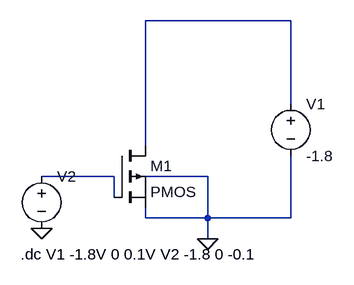
[diagram p0: schematic pmos.asc]
pmos.asc, the LTspice schematic file:
Version 4
SHEET 1 880 680
WIRE 384 -64 160 -64
WIRE 384 64 384 -64
WIRE 160 128 160 -64
WIRE 112 176 0 176
WIRE 256 176 160 176
WIRE 112 208 112 176
WIRE 160 240 160 224
WIRE 256 240 256 176
WIRE 256 240 160 240
WIRE 384 240 384 144
WIRE 384 240 256 240
WIRE 256 272 256 240
FLAG 256 272 0
FLAG 0 256 0
SYMBOL voltage 384 48 R0
WINDOW 123 0 0 Left 0
WINDOW 39 0 0 Left 0
SYMATTR InstName V1
SYMATTR Value -1.8
SYMBOL voltage 0 160 R0
WINDOW 123 0 0 Left 0
WINDOW 39 0 0 Left 0
SYMATTR InstName V2
SYMATTR Value ""
SYMBOL pmos 112 128 R0
SYMATTR InstName M1
TEXT -32 296 Left 2 !.dc V1 -1.8V 0 0.1V V2 -1.8 0 -0.1

The netlist it stands for:
* pmos.asc
V1 N001 0 -1.8
V2 N002 0
M1 N001 N002 0 0 PMOS
.model NMOS NMOS
.model PMOS PMOS
.lib standard.mos
.dc V1 -1.8V 0 0.1V V2 -1.8 0 -0.1
.backanno
.end